# Altium schematic sheet OutputFilter.SchDoc
size A; SheetNumber: 3; SheetTotal: 5
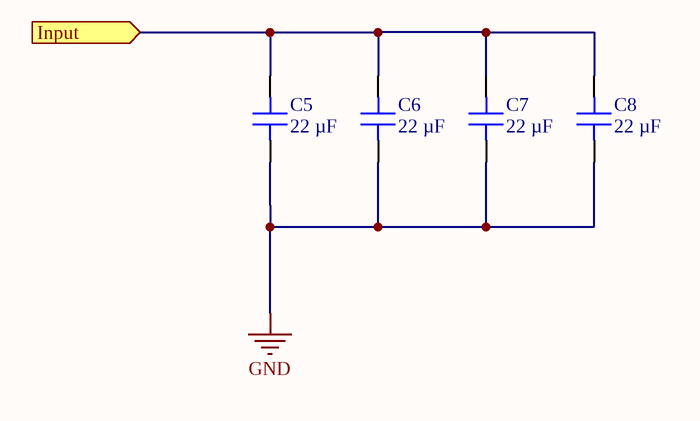
[diagram p0: OutputFilter.SchDoc]

## Parts
C5  22 µF  [CAP 1812_4532 1.1MM]
C6  22 µF  [CAP 1812_4532 1.1MM]
C7  22 µF  [CAP 1812_4532 1.1MM]
C8  22 µF  [CAP 1812_4532 1.1MM]

## Ports
Input (in)

## Nets
GND: C5.1 C6.1 C7.1 C8.1
Input: C5.2 C6.2 C7.2 C8.2 ; port Input

## Library data of the parts
C5-C8 = CGA8P1X7R1E226M250KC: CAP CER 22UF 25V X7R 1812; manufacturer: TDK Corporation; Tolerance: ±20%; Part Number: CGA8P1X7R1E226M250KC; Value: 22 µF; Applications: Automotive; Capacitance: 22 µF; componentlink1description: Datasheet; componentlink1url: https://product.tdk.com/info/en/catalog/datasheets/mlcc_automotive_general_en.pdf?ref_disty=digikey; componentlink2description: DigiKey Link; componentlink2url: https://www.digikey.com/en/products/detail/tdk-corporation/CGA8P1X7R1E226M250KC/2781336; Device Package: 1812 (4532 Metric); lastupdated: 7/15/2023 7:18:32 PM; Lifecycle Status: Active; Minimum Order: 1; Mounting Type: Surface Mount, MLCC; Operating Temperature: -55°C ~ 125°C; Package / Case: 1812 (4532 Metric); packaging: TapeAndReel; Part Status: Active; price: 0.42; Ratings: AEC-Q200; series: CGA; Size / Dimension: 0.177" L x 0.126" W (4.50mm x 3.20mm); Supplier 1: DigiKey; Supplier Part Number 1: 445-7910-1-ND; Temperature Coefficient: X7R; Thickness (Max): 0.110" (2.80mm); Voltage - Rated: 25V